# Altium schematic sheet HoloCubicConnectV02_220109.SchDoc
size A4
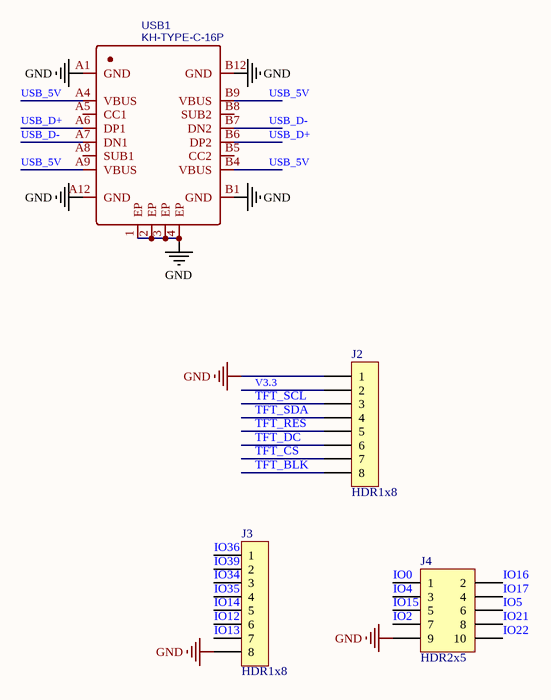
[diagram p0: HoloCubicConnectV02_220109.SchDoc]

## Parts
J2  HDR1x8  [PIN-8-2.54-1.0]
J3  HDR1x8  [PIN-8-2.54-1.0]
J4  HDR2x5  [PIN-2x5-2.54-1.0]
USB1  KH-TYPE-C-16P  [USB-C-SMD_KH-TYPE-C-16P]

## Nets
GND: J2.1 J3.8 J4.9 USB1.1(EP) USB1.2(EP) USB1.3(EP) USB1.4(EP) USB1.A1(GND) USB1.A12(GND) USB1.B1(GND) USB1.B12(GND)
IO0: J4.1
IO2: J4.7
IO4: J4.3
IO5: J4.6
IO12: J3.6
IO13: J3.7
IO14: J3.5
IO15: J4.5
IO16: J4.2
IO17: J4.4
IO21: J4.8
IO22: J4.10
IO34: J3.3
IO35: J3.4
IO36: J3.1
IO39: J3.2
TFT_BLK: J2.8
TFT_CS: J2.7
TFT_DC: J2.6
TFT_RES: J2.5
TFT_SCL: J2.3
TFT_SDA: J2.4
USB_5V: USB1.A4(VBUS) USB1.A9(VBUS) USB1.B4(VBUS) USB1.B9(VBUS)
USB_D+: USB1.A6(DP1) USB1.B6(DP2)
USB_D-: USB1.A7(DN1) USB1.B7(DN2)
V3.3: J2.2

Not connected (* = marked no-connect by the designer): USB1 A5(CC1) A8(SUB1) B5(CC2) B8(SUB2)

## Library data of the parts
J2 J3 = HDR1x8: Connector
J4 = HDR2x5: Connector
USB1 = KH-TYPE-C-16P: BOM_Manufacturer: Shenzhen Kinghelm Elec; Contributor: LCSC; BOM_Supplier: LCSC; BOM_Supplier Part: C709357; BOM_Manufacturer Part: KH-TYPE-C-16P; BOM_JLCPCB Part Class: Extended Part; spicePre: U; spiceSymbolName: KH-TYPE-C-16P